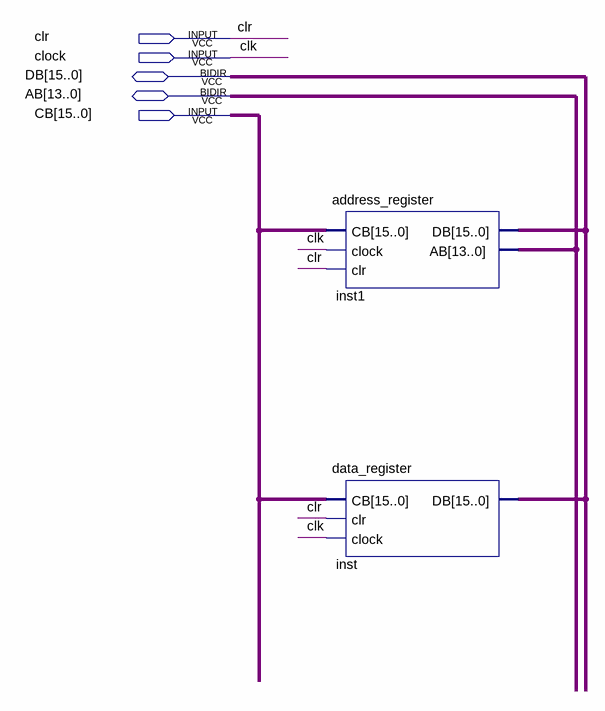
[diagram p0: schematic sheet]
// Quartus schematic special_registers.bdf as structural Verilog: 2 symbols, 5 pins
module special_registers (
  input  clr,
  input  clock,
  input  [15:0] CB,
  inout  [15:0] DB,
  inout  [13:0] AB
);

  address_register inst1 (.CB(CB), .clock(clock), .clr(clr), .AB(AB), .DB(DB));
  data_register inst (.CB(CB), .clr(clr), .clock(clock), .DB(DB));

  // Other names for the same wires on the sheet: clk = clock
endmodule
